# EasyEDA schematic SCH_ESP_toster_V3.json
TITLE: ESP_TOSTERV0; REV: 1.0; Date: 2021-05-25; Sheet: 1/1; Drawn By: maxior76; Company: Your Company
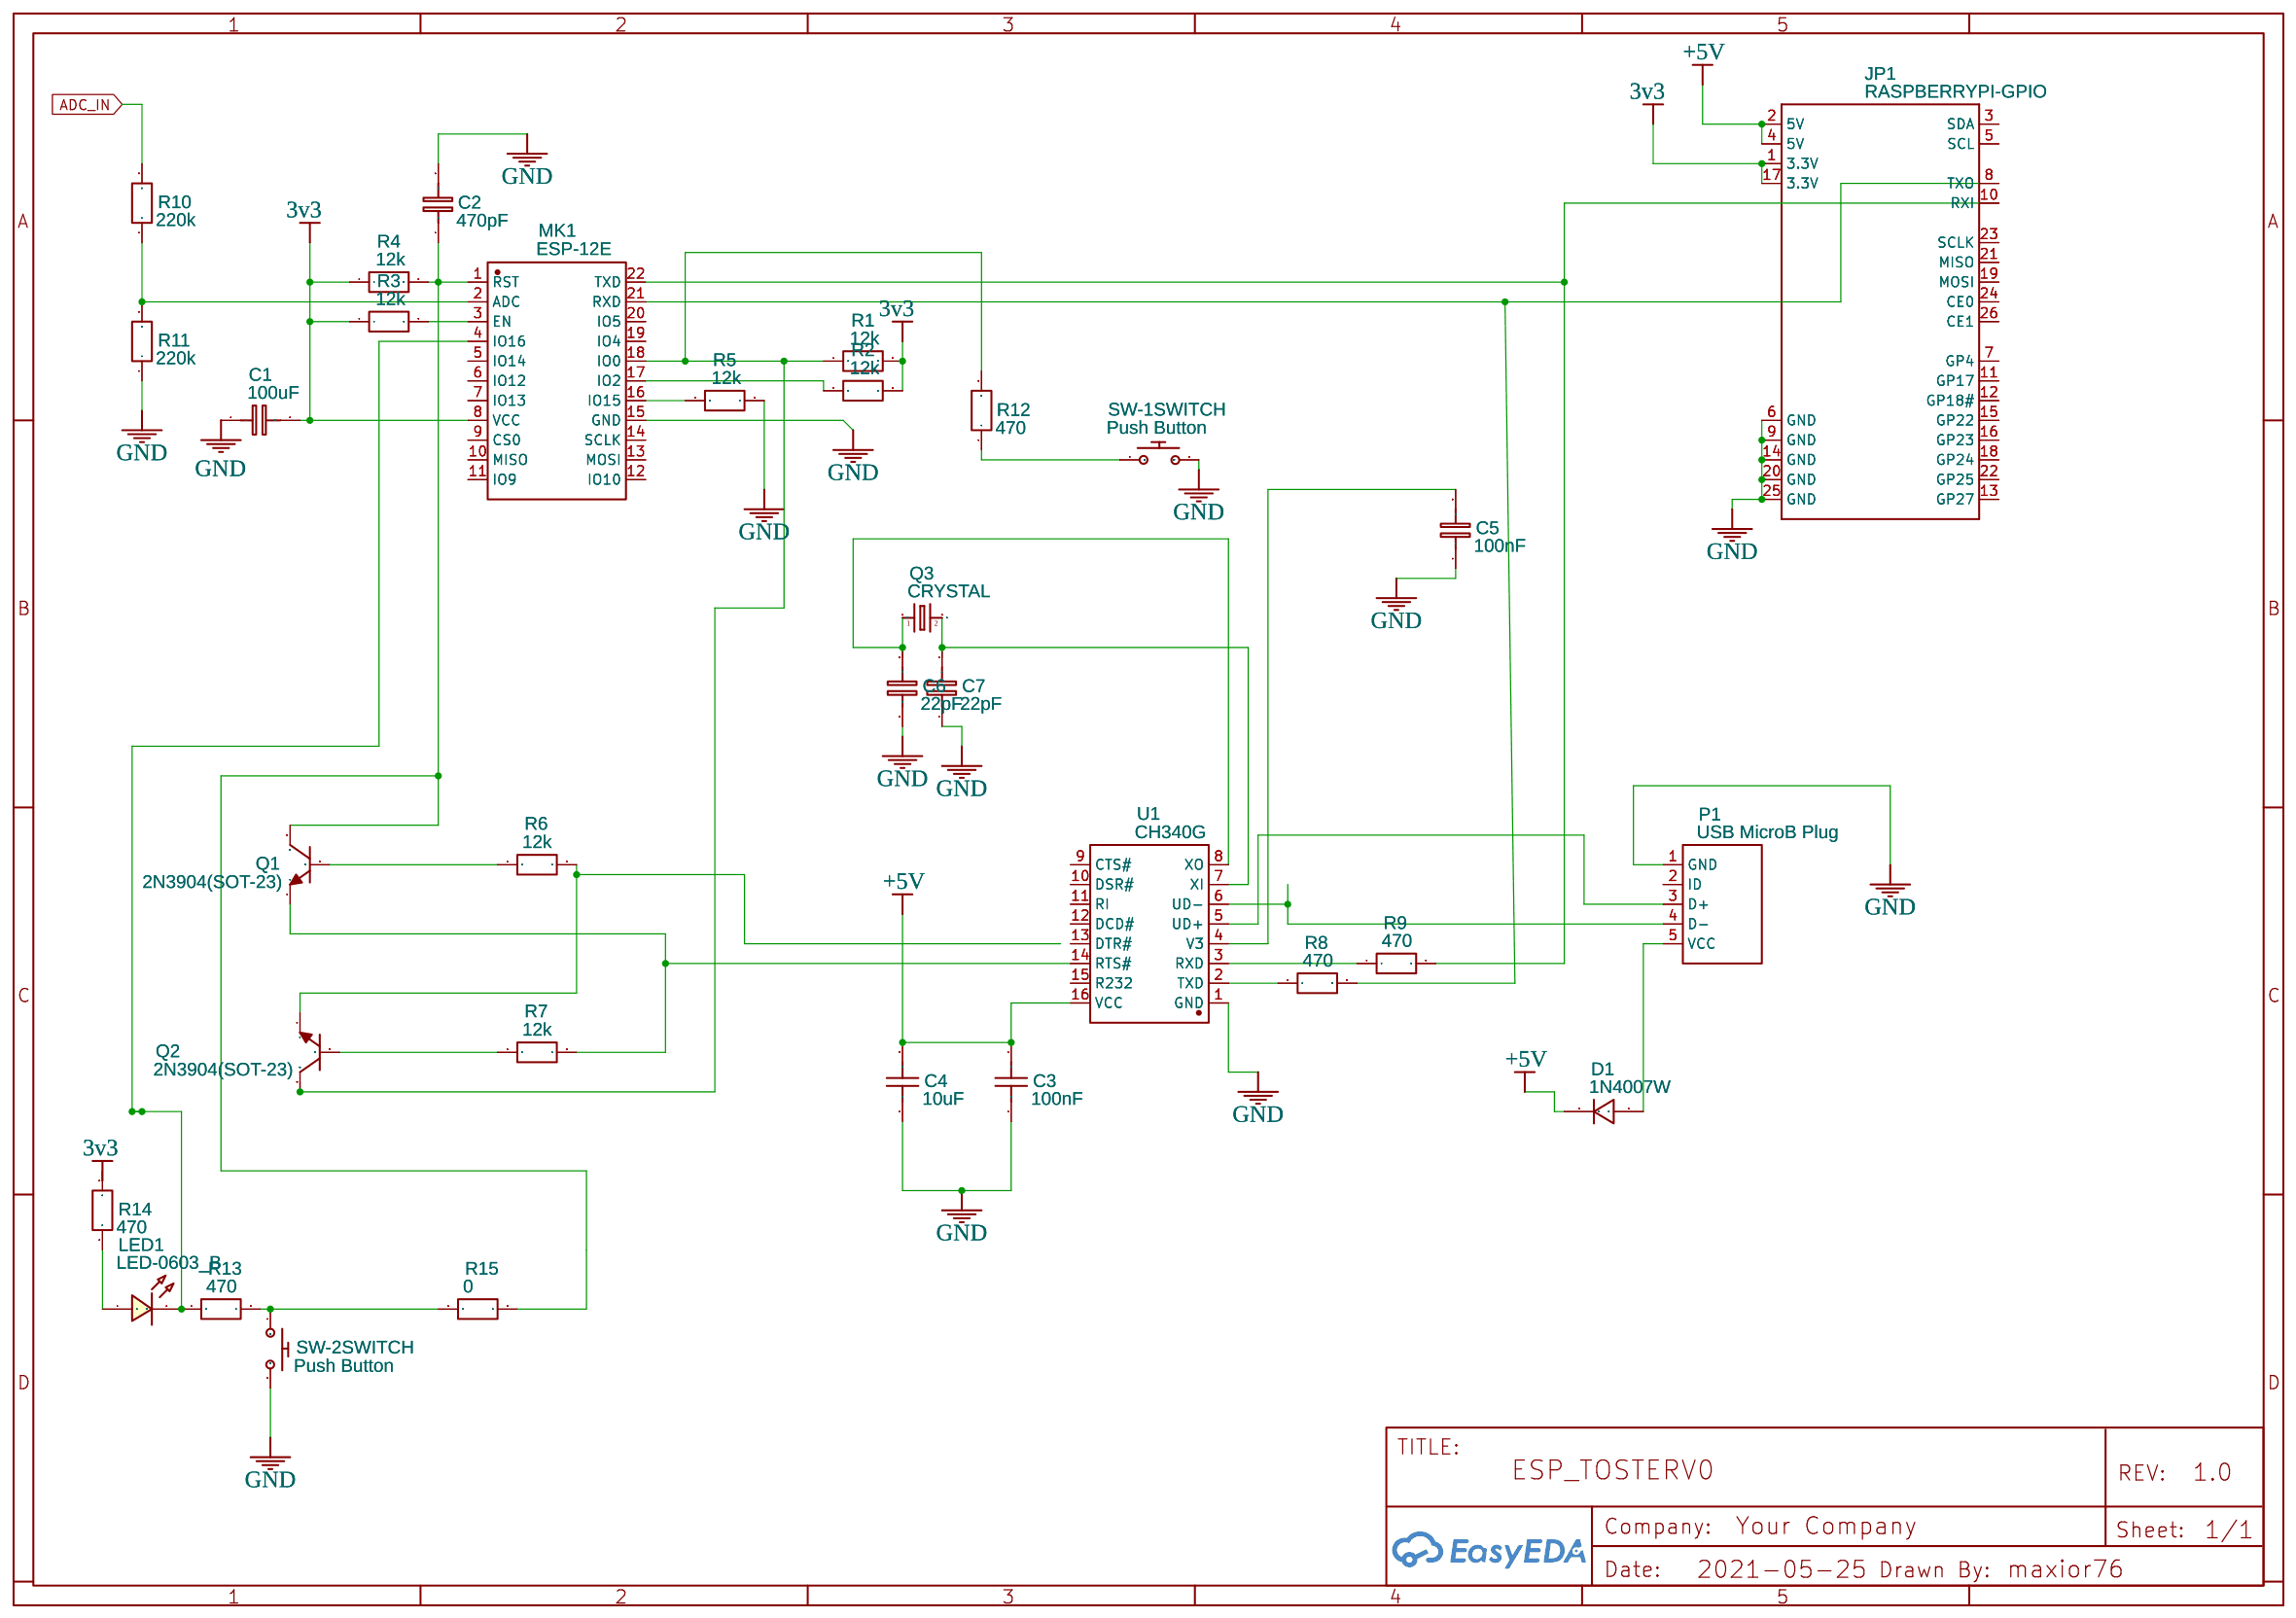
[diagram p0: schematic sheet]

## Parts
C1  100uF  [C0603]
C2  470pF  [C0603]
C3  100nF  [C0603]
C4  10uF  [C0603]
C5  100nF  [C0603]
C6  22pF  [C0603]
C7  22pF  [C0603]
D1  1N4007W  [SOD-123_L2.8-W1.8-LS3.7-RD]
JP1  RASPBERRYPI-GPIO  [2X13-SHROUDED]
LED1  LED-0603_B  [LED0603_RED]
MK1  ESP-12E  [WIFIM-SMD_ESP-12E]
P1  USB MicroB Plug  [USB MICROB PLUG]
Q1  2N3904(SOT-23)  [SOT-23-3_L2.9-W1.3-P1.90-LS2.4-TR]
Q2  2N3904(SOT-23)  [SOT-23-3_L2.9-W1.3-P1.90-LS2.4-TR]
Q3  CRYSTAL  [HC49S]
R1  12k  [R0603]
R2  12k  [R0603]
R3  12k  [R0603]
R4  12k  [R0603]
R5  12k  [R0603]
R6  12k  [R0603]
R7  12k  [R0603]
R8  470  [R0603]
R9  470  [R0603]
R10  220k  [R0603]
R11  220k  [R0603]
R12  470  [R0603]
R13  470  [R0603]
R14  470  [R0603]
R15  0  [R0603]
SW-1SWITCH  Push Button  [SMD-BUTTON]
SW-2SWITCH  Push Button  [SMD-BUTTON]
U1  CH340G  [SOIC-16_L9.9-W3.9-P1.27-LS6.0-BR]

## Library data of the parts
C1 C2 C5-C7 = C_0603_EU: Contributor: LCEDA_Lib
C3 C4 = C_0603_US: Contributor: LCEDA_Lib
D1 = 1N4007W: Supplier: LCSC; Supplier Part: C328592; Manufacturer: BLUE ROCKET; Contributor: LCEDA_Lib
JP1 = RASPBERRYPI-GPIO: Contributor: SparkFun
LED1 = LED-0603_R: Manufacturer: EVERLIGHT(台湾亿光); Manufacturer Part: 19-217/R6C-AL1M2VY/3T; Supplier Part: C72044; Supplier: LCSC; Contributor: LCEDA_01
MK1 = ESP-12E: Supplier: LCSC; Manufacturer: Ai-Thinker; Supplier Part: C89297; JLCPCB Part Class: Extended Part
P1 = USB MicroB Plug: sourceId: 1T5FDZYC8
Q1 Q2 = 2N3904(SOT-23): Supplier: LCSC; Manufacturer: KEC; Manufacturer Part: 2n3904S-RTK/PS; Supplier Part: C18536; Paste Type: SOT-23; Contributor: LCEDA_Lib
Q3 = CRYSTAL: Contributor: Adafruit
R1-R15 = R_0603_EU: Contributor: LCEDA_Lib
SW-1SWITCH SW-2SWITCH = Push Button: sourceId: M82WewO60; Supplier Part: COM-08720; Supplier: SparkFun
U1 = CH340G: Supplier: LCSC; Manufacturer: WCH; Supplier Part: C14267; JLCPCB Part Class: Basic Part

## Nets
3v3: C1.2 JP1.1(3.3V) JP1.17(3.3V) MK1.8(VCC) R1.2 R2.2 R3.1 R4.1 R14.2
+5V: C3.2 C4.2 D1.1 JP1.2(5V) JP1.4(5V) U1.16(VCC)
GND: C1.1 C2.2 C3.1 C4.1 C5.1 C6.1 C7.1 JP1.6(GND) JP1.9(GND) JP1.14(GND) JP1.20(GND) JP1.25(GND) MK1.15(GND) P1.1(GND) R5.2 R11.1 SW-1SWITCH.2(P$2) SW-2SWITCH.2(P$2) U1.1(GND)
ADC_IN: R10.2
Net-(C2-1): C2.1 MK1.1(RST) Q1.3(C) R4.2 R15.2
Net-(C5-2): C5.2 U1.4(V3)
Net-(C6-2): C6.2 Q3.1 U1.8(XO)
Net-(C7-2): C7.2 Q3.2 U1.7(XI)
Net-(D1-2): D1.2 P1.5(VCC)
Net-(JP1-8): JP1.8(TXO) MK1.21(RXD) R8.2
Net-(JP1-10): JP1.10(RXI) MK1.22(TXD) R9.2
Net-(LED1-1): LED1.1 R14.1
Net-(LED1-2): LED1.2 MK1.4(IO16) R13.1
Net-(MK1-2): MK1.2(ADC) R10.1 R11.2
Net-(MK1-3): MK1.3(EN) R3.2
Net-(MK1-16): MK1.16(IO15) R5.1
Net-(MK1-17): MK1.17(IO2) R2.1
Net-(MK1-18): MK1.18(IO0) Q2.3(C) R1.1 R12.2
Net-(P1-3): P1.3(D+) U1.5(UD+)
Net-(P1-4): P1.4(D-) U1.6(UD-)
Net-(Q1-1): Q1.1(E) R7.2 U1.14(RTS#)
Net-(Q1-2): Q1.2(B) R6.1
Net-(Q2-1): Q2.1(E) R6.2
Net-(Q2-2): Q2.2(B) R7.1
Net-(R8-1): R8.1 U1.2(TXD)
Net-(R9-1): R9.1 U1.3(RXD)
Net-(R12-1): R12.1 SW-1SWITCH.1(P$1)
Net-(R13-2): R13.2 R15.1 SW-2SWITCH.1(P$1)

Not connected (* = marked no-connect by the designer): JP1 3(SDA) 5(SCL) 7(GP4) 11(GP17) 12(GP18#) 13(GP27) 15(GP22) 16(GP23) 18(GP24) 19(MOSI) 21(MISO) 22(GP25) 23(SCLK) 24(CE0) 26(CE1); MK1 5(IO14) 6(IO12) 7(IO13) 9(CS0) 10(MISO) 11(IO9) 12(IO10) 13(MOSI) 14(SCLK) 19(IO4) 20(IO5); P1 2(ID); U1 9(CTS#) 10(DSR#) 11(RI) 12(DCD#) 13(DTR#) 15(R232)
